# EAGLE design plc-6u-rs485-router (EAGLE 6.2)
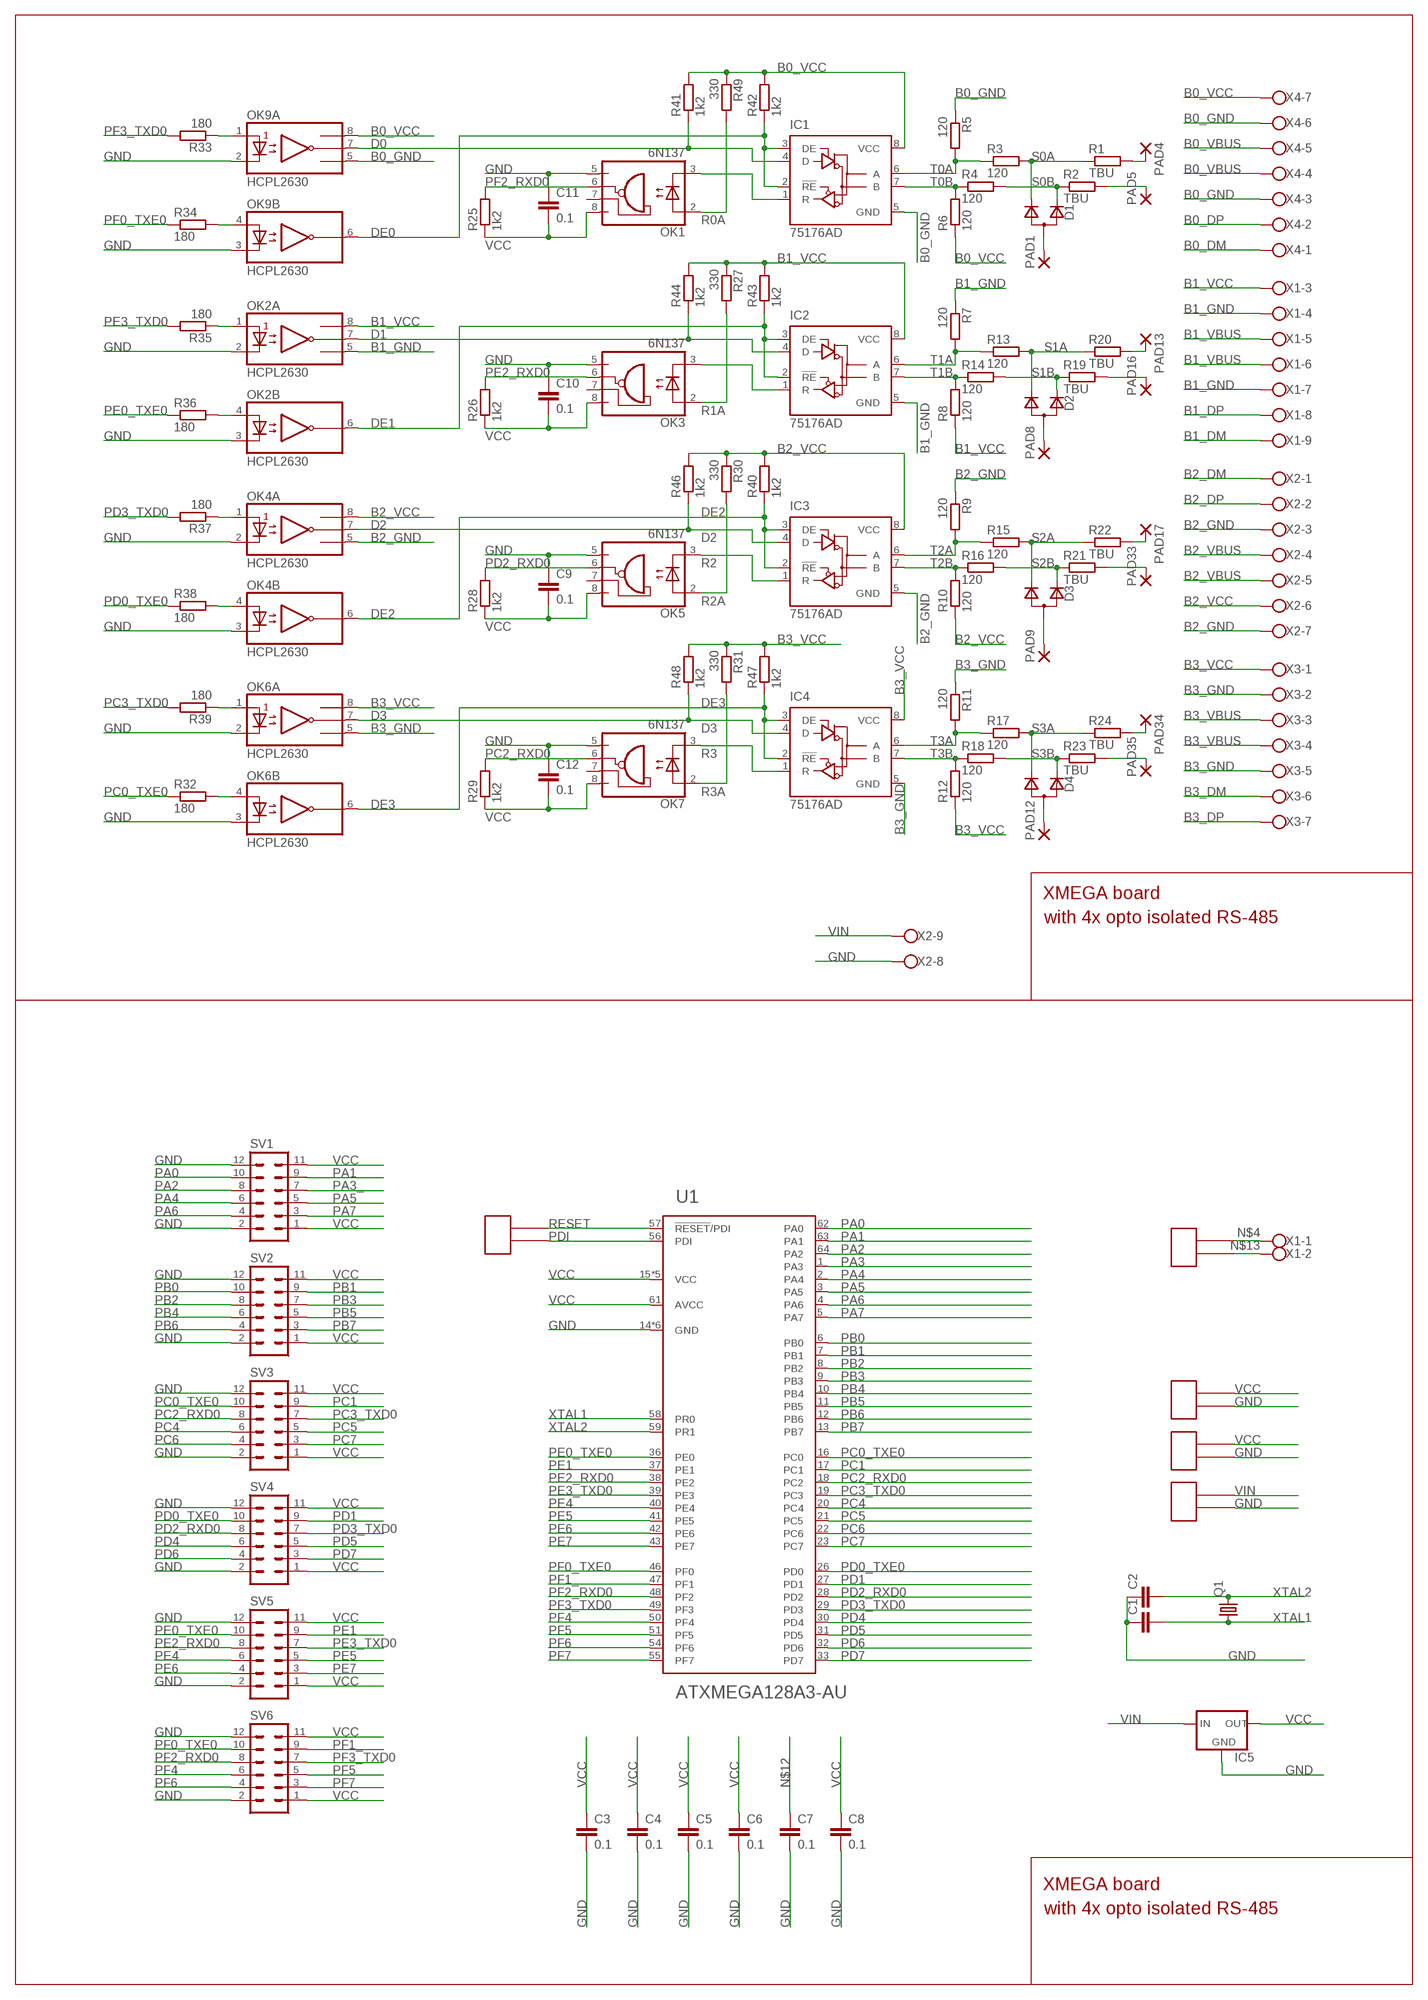
[diagram p0: schematic, sheet 1]

## Parts
C1  C-EUC0805  [C0805]
C2  C-EUC0805  [C0805]
C3  0.1  C-EUC0603  [C0603]
C4  0.1  C-EUC0603  [C0603]
C5  0.1  C-EUC0603  [C0603]
C6  0.1  C-EUC0603  [C0603]
C7  0.1  C-EUC0603  [C0603]
C8  0.1  C-EUC0603  [C0603]
C9  0.1  C-EUC1206  [C1206]
C10  0.1  C-EUC1206  [C1206]
C11  0.1  C-EUC1206  [C1206]
C12  0.1  C-EUC1206  [C1206]
D1  D_2CSOT323  [SOT323]
D2  D_2CSOT323  [SOT323]
D3  D_2CSOT323  [SOT323]
D4  D_2CSOT323  [SOT323]
IC1  75176AD  [D_R-PDSO-G8]
IC2  75176AD  [D_R-PDSO-G8]
IC3  75176AD  [D_R-PDSO-G8]
IC4  75176AD  [D_R-PDSO-G8]
IC5  LM1117TO252  [TO252]
OK1  6N137  [DIL08]
OK2  HCPL2630  [DIL08]
OK3  6N137  [DIL08]
OK4  HCPL2630  [DIL08]
OK5  6N137  [DIL08]
OK6  HCPL2630  [DIL08]
OK7  6N137  [DIL08]
OK9  HCPL2630  [DIL08]
PAD1  2,54/0,8  [2,54/0,8]
PAD4  2,54/0,8  [2,54/0,8]
PAD5  2,54/0,8  [2,54/0,8]
PAD8  2,54/0,8  [2,54/0,8]
PAD9  2,54/0,8  [2,54/0,8]
PAD12  2,54/0,8  [2,54/0,8]
PAD13  2,54/0,8  [2,54/0,8]
PAD16  2,54/0,8  [2,54/0,8]
PAD17  2,54/0,8  [2,54/0,8]
PAD33  2,54/0,8  [2,54/0,8]
PAD34  2,54/0,8  [2,54/0,8]
PAD35  2,54/0,8  [2,54/0,8]
Q1  CRYSTALHC49S  [HC49/S]
R1  TBU  R-EU_WSC2515  [WSC2515]
R2  TBU  R-EU_WSC2515  [WSC2515]
R3  120  R-EU_R0805  [R0805]
R4  120  R-EU_R0805  [R0805]
R5  120  R-EU_R0805  [R0805]
R6  120  R-EU_R0805  [R0805]
R7  120  R-EU_R0805  [R0805]
R8  120  R-EU_R0805  [R0805]
R9  120  R-EU_R0805  [R0805]
R10  120  R-EU_R0805  [R0805]
R11  120  R-EU_R0805  [R0805]
R12  120  R-EU_R0805  [R0805]
R13  120  R-EU_R0805  [R0805]
R14  120  R-EU_R0805  [R0805]
R15  120  R-EU_R0805  [R0805]
R16  120  R-EU_R0805  [R0805]
R17  120  R-EU_R0805  [R0805]
R18  120  R-EU_R0805  [R0805]
R19  TBU  R-EU_WSC2515  [WSC2515]
R20  TBU  R-EU_WSC2515  [WSC2515]
R21  TBU  R-EU_WSC2515  [WSC2515]
R22  TBU  R-EU_WSC2515  [WSC2515]
R23  TBU  R-EU_WSC2515  [WSC2515]
R24  TBU  R-EU_WSC2515  [WSC2515]
R25  1k2  R-EU_R0805  [R0805]
R26  1k2  R-EU_R0805  [R0805]
R27  330  R-EU_R0805  [R0805]
R28  1k2  R-EU_R0805  [R0805]
R29  1k2  R-EU_R0805  [R0805]
R30  330  R-EU_R0805  [R0805]
R31  330  R-EU_R0805  [R0805]
R32  180  R-EU_R1206  [R1206]
R33  180  R-EU_R0805  [R0805]
R34  180  R-EU_R1206  [R1206]
R35  180  R-EU_R0805  [R0805]
R36  180  R-EU_R1206  [R1206]
R37  180  R-EU_R0805  [R0805]
R38  180  R-EU_R1206  [R1206]
R39  180  R-EU_R0805  [R0805]
R40  1k2  R-EU_0207/10  [0207/10]
R41  1k2  R-EU_0207/10  [0207/10]
R42  1k2  R-EU_0207/10  [0207/10]
R43  1k2  R-EU_R0805  [R0805]
R44  1k2  R-EU_R0805  [R0805]
R46  1k2  R-EU_0207/10  [0207/10]
R47  1k2  R-EU_R0805  [R0805]
R48  1k2  R-EU_R0805  [R0805]
R49  330  R-EU_R0805  [R0805]
SV1  MA06-2  [MA06-2]
SV2  MA06-2  [MA06-2]
SV3  MA06-2  [MA06-2]
SV4  MA06-2  [MA06-2]
SV5  MA06-2  [MA06-2]
SV6  MA06-2  [MA06-2]
U1  ATXMEGA128A3-AU  [TQFP-64A-64]
U$1  MA02-1  [MA02-1]
U$2  MA02-1  [MA02-1]
U$3  MA02-1  [MA02-1]
U$4  MA02-1  [MA02-1]
U$5  MA02-1  [MA02-1]
X1  W237-09P  [W237-9P]
X2  W237-09P  [W237-9P]
X3  W237-07P  [W237-7P]
X4  W237-07P  [W237-7P]

## Nets
B0_DM: PAD4.1(P) R1.2 X4.1
B0_DP: PAD5.1(P) R2.2 X4.2
B0_GND: D1.1(A) IC1.5(GND) OK9.5(A:GND) PAD1.1(P) R5.1 X4.3 X4.6
B0_VBUS: X4.4 X4.5
B0_VCC: IC1.8(VCC) OK9.8(A:VCC) R6.1 R41.2 R42.2 R49.1 X4.7
B1_DM: PAD16.1(P) R19.2 X1.9
B1_DP: PAD13.1(P) R20.2 X1.8
B1_GND: D2.1(A) IC2.5(GND) OK2.5(A:GND) PAD8.1(P) R7.1 X1.4 X1.7
B1_VBUS: X1.5 X1.6
B1_VCC: IC2.8(VCC) OK2.8(A:VCC) R8.1 R27.1 R43.2 R44.2 X1.3
B2_DM: PAD17.1(P) R22.2 X2.1
B2_DP: PAD33.1(P) R21.2 X2.2
B2_GND: D3.1(A) IC3.5(GND) OK4.5(A:GND) PAD9.1(P) R9.1 X2.3 X2.7
B2_VBUS: X2.4 X2.5
B2_VCC: IC3.8(VCC) OK4.8(A:VCC) R10.1 R30.1 R40.2 R46.2 X2.6
B3_DM: PAD34.1(P) R24.2 X3.6
B3_DP: PAD35.1(P) R23.2 X3.7
B3_GND: D4.1(A) IC4.5(GND) OK6.5(A:GND) PAD12.1(P) R11.1 X3.2 X3.5
B3_VBUS: X3.3 X3.4
B3_VCC: IC4.8(VCC) OK6.8(A:VCC) R12.1 R31.1 R47.2 R48.2 X3.1
D0: IC1.4(D) OK9.7(A:VO1) R41.1
D1: IC2.4(D) OK2.7(A:VO1) R44.1
D2: IC3.4(D) OK4.7(A:VO1) R46.1
D3: IC4.4(D) OK6.7(A:VO1) R48.1
DE0: IC1.2(!RE) IC1.3(DE) OK9.6(B:VO2) R42.1
DE1: IC2.2(!RE) IC2.3(DE) OK2.6(B:VO2) R43.1
DE2: IC3.2(!RE) IC3.3(DE) OK4.6(B:VO2) R40.1
DE3: IC4.2(!RE) IC4.3(DE) OK6.6(B:VO2) R47.1
GND: C1.1 C2.1 C3.2 C4.2 C5.2 C6.2 C7.2 C8.2 C9.1 C10.1 C11.1 C12.1 IC5.1(GND) OK1.5(GND) OK2.2(A:C1) OK2.3(B:C2) OK3.5(GND) OK4.2(A:C1) OK4.3(B:C2) OK5.5(GND) OK6.2(A:C1) OK6.3(B:C2) OK7.5(GND) OK9.2(A:C1) OK9.3(B:C2) SV1.2 SV1.12 SV2.2 SV2.12 SV3.2 SV3.12 SV4.2 SV4.12 SV5.2 SV5.12 SV6.2 SV6.12 U1.14(GND) U1.24(GND) U1.34(GND) U1.44(GND) U1.52(GND) U1.60(GND) U$2.P1 U$3.P1 U$4.P1 X2.8
N$1: OK9.4(B:A2) R34.2
N$2: OK2.4(B:A2) R36.2
N$4: U$5.P2 X1.1
N$5: OK2.1(A:A1) R35.1
N$7: OK4.1(A:A1) R37.1
N$8: OK9.1(A:A1) R33.1
N$9: OK4.4(B:A2) R38.2
N$12: C7.1
N$13: U$5.P1 X1.2
PA0: SV1.10 U1.62(PA0)
PA1: SV1.9 U1.63(PA1)
PA2: SV1.8 U1.64(PA2)
PA3: U1.1(PA3)
PA3_: SV1.7
PA4: SV1.6 U1.2(PA4)
PA5: SV1.5 U1.3(PA5)
PA6: SV1.4 U1.4(PA6)
PA7: SV1.3 U1.5(PA7)
PB0: SV2.10 U1.6(PB0)
PB1: SV2.9 U1.7(PB1)
PB2: SV2.8 U1.8(PB2)
PB3: SV2.7 U1.9(PB3)
PB4: SV2.6 U1.10(PB4)
PB5: SV2.5 U1.11(PB5)
PB6: SV2.4 U1.12(PB6)
PB7: SV2.3 U1.13(PB7)
PC0_TXE0: R32.1 SV3.10 U1.16(PC0)
PC1: SV3.9 U1.17(PC1)
PC2_RXD0: OK7.6(VO) R29.2 SV3.8 U1.18(PC2)
PC3_TXD0: R39.2 SV3.7 U1.19(PC3)
PC4: SV3.6 U1.20(PC4)
PC5: SV3.5 U1.21(PC5)
PC6: SV3.4 U1.22(PC6)
PC7: SV3.3 U1.23(PC7)
PD0_TXE0: R38.1 SV4.10 U1.26(PD0)
PD1: SV4.9 U1.27(PD1)
PD2_RXD0: OK5.6(VO) R28.2 SV4.8 U1.28(PD2)
PD3_TXD0: R37.2 SV4.7 U1.29(PD3)
PD4: SV4.6 U1.30(PD4)
PD5: SV4.5 U1.31(PD5)
PD6: SV4.4 U1.32(PD6)
PD7: SV4.3 U1.33(PD7)
PDI: U1.56(PDI) U$1.P1
PE0_TXE0: R36.1 SV5.10 U1.36(PE0)
PE1: SV5.9 U1.37(PE1)
PE2_RXD0: OK3.6(VO) R26.2 SV5.8 U1.38(PE2)
PE3_TXD0: R35.2 SV5.7 U1.39(PE3)
PE4: SV5.6 U1.40(PE4)
PE5: SV5.5 U1.41(PE5)
PE6: SV5.4 U1.42(PE6)
PE7: SV5.3 U1.43(PE7)
PF0_TXE0: R34.1 SV6.10 U1.46(PF0)
PF1_: SV6.9 U1.47(PF1)
PF2_RXD0: OK1.6(VO) R25.2 SV6.8 U1.48(PF2)
PF3_TXD0: R33.2 SV6.7 U1.49(PF3)
PF4: SV6.6 U1.50(PF4)
PF5: SV6.5 U1.51(PF5)
PF6: SV6.4 U1.54(PF6)
PF7: SV6.3 U1.55(PF7)
R0: IC1.1(R) OK1.3(C)
R0A: OK1.2(A) R49.2
R1: IC2.1(R) OK3.3(C)
R1A: OK3.2(A) R27.2
R2: IC3.1(R) OK5.3(C)
R2A: OK5.2(A) R30.2
R3: IC4.1(R) OK7.3(C)
R3A: OK7.2(A) R31.2
RESET: U1.57(!RESET!/PDI) U$1.P2
S0A: D1.3(C2) R1.1 R3.2
S0B: D1.2(C1) R2.1 R4.2
S1A: D2.3(C2) R13.2 R20.1
S1B: D2.2(C1) R14.2 R19.1
S2A: D3.3(C2) R15.2 R22.1
S2B: D3.2(C1) R16.2 R21.1
S3A: D4.3(C2) R17.2 R24.1
S3B: D4.2(C1) R18.2 R23.1
T0A: IC1.6(A) R3.1 R5.2
T0B: IC1.7(B) R4.1 R6.2
T1A: IC2.6(A) R7.2 R13.1
T1B: IC2.7(B) R8.2 R14.1
T2A: IC3.6(A) R9.2 R15.1
T2B: IC3.7(B) R10.2 R16.1
T3A: IC4.6(A) R11.2 R17.1
T3B: IC4.7(B) R12.2 R18.1
TX3A: OK6.1(A:A1) R39.1
TXE3A: OK6.4(B:A2) R32.2
VCC: C3.1 C4.1 C5.1 C6.1 C8.1 C9.2 C10.2 C11.2 C12.2 IC5.3(OUT) OK1.8(VCC) OK3.8(VCC) OK5.8(VCC) OK7.8(VCC) R25.1 R26.1 R28.1 R29.1 SV1.1 SV1.11 SV2.1 SV2.11 SV3.1 SV3.11 SV4.1 SV4.11 SV5.1 SV5.11 SV6.1 SV6.11 U1.15(VCC) U1.25(VCC) U1.35(VCC) U1.45(VCC) U1.53(VCC) U1.61(AVCC) U$2.P2 U$3.P2
VIN: IC5.2(IN) U$4.P2 X2.9
XTAL1: C1.2 Q1.1 U1.58(PR0)
XTAL2: C2.2 Q1.2 U1.59(PR1)
Unconnected: OK1.7(VE) OK3.7(VE) OK5.7(VE) OK7.7(VE)

## Notes on the sheet
- XMEGA board
- with 4x opto isolated RS-485
- XMEGA board
- with 4x opto isolated RS-485

## Library data of the parts
C1-C12 = rcl:C-EU: CAPACITOR, European symbol
D1-D4 = zetex:D_2C: Dual DIODE; OC_FARNELL: unknown; OC_NEWARK: unknown
IC1-IC4 = 751xx:75176A: DIFFERENTIAL BUS TRANSCEIVER Source: http://focus.ti.com/lit/ds/symlink/sn75176a.pdf
IC5 = my-v-reg-3:LM1117
OK1 OK3 OK5 OK7 = optocoupler:6N137: MOTOROLA OPTO COUPLER; MPN: 6N137; OC_FARNELL: 1328376; OC_NEWARK: 52M1895
OK2 OK4 OK6 OK9 = optocoupler:HCPL2630: HEWLETT PACKARD OPTO COUPLER; MF: AGILENT TECHNOLOGIES; MPN: HCPL-2630-000E; OC_FARNELL: 9994904; OC_NEWARK: 88H7813
PAD1 PAD4 PAD5 PAD8 PAD9 PAD12 PAD13 PAD16 PAD17 PAD33-PAD35 = wirepad:2,54/0,8: THROUGH-HOLE PAD
Q1 = crystal:CRYSTAL: CRYSTAL
R1-R39 R43 R44 R47-R49 = rcl:R-EU_: RESISTOR, European symbol
R40-R42 R46 = resistor:R-EU_: RESISTOR, European symbol
SV1-SV6 = con-lstb:MA06-2: PIN HEADER; OC_FARNELL: unknown; OC_NEWARK: unknown
U1 = atmel-xmega:ATXMEGA128A3: 8/16-bit XMEGA A3 Microcontroller Features High-performance, Low-power 8/16-bit Atmel® AVR® XMEGATM Microcontroller Non-volatile Program and Data Memories – 64 KB - 256 KB of In-System Self-Programmable Flash – 4 KB - 8 KB Boot Code Section with Independent Lock Bits – 2 KB - 4 KB EEPROM – 4 KB - 16 KB Internal SRAM Peripheral Features – Four-channel DMA Controller with support for external requests – Eight-channel Event System – Seven 16-bit Timer/Counters Four Timer/Counters with 4 Output Compare or Input Capture channels Three Timer/Counters with 2 Output Compare or Input Capture channels High Resolution Extensions on all Timer/Counters Advanced Waveform Extension on one Timer/Counter – Seven USARTs IrDA Extension on 1 USART – AES and DES Crypto Engine – Two Two-wire Interfaces with dual address match (I2C and SMBus compatible) – Three SPI (Serial Peripheral Interfaces) – 16-bit Real Time Counter with Separate Oscillator – Two Eight-channel, 12-bit, 2 Msps Analog to Digital Converters – One Two-channel, 12-bit, 1 Msps Digital to Analog Converter – Four Analog Comparators with Window compare function – External Interrupts on all General Purpose I/O pins – Programmable Watchdog Timer with Separate On-chip Ultra Low Power Oscillator Special Microcontroller Features – Power-on Reset and Programmable Brown-out Detection – Internal and External Clock Options with PLL – Programmable Multi-level Interrupt Controller – Sleep Modes: Idle, Power-down, Standby, Power-save, Extended Standby – Advanced Programming, Test and Debugging Interfaces JTAG (IEEE 1149.1 Compliant) Interface for test, debug and programming PDI (Program and Debug Interface) for programming, test and debugging I/O and Packages – 50 Programmable I/O Lines – 64-lead TQFP – 64-pad QFN Operating Voltage – 1.6 – 3.6V Speed performance – 0 – 12 MHz @ 1.6 – 3.6V – 0 – 32 MHz @ 2.7 – 3.6V
U$1-U$5 = my-con:MA02-1
X1 X2 = con-wago-508:W237-09P: WAGO SREW CLAMP
X3 X4 = con-wago-508:W237-07P: WAGO SREW CLAMP

## Board
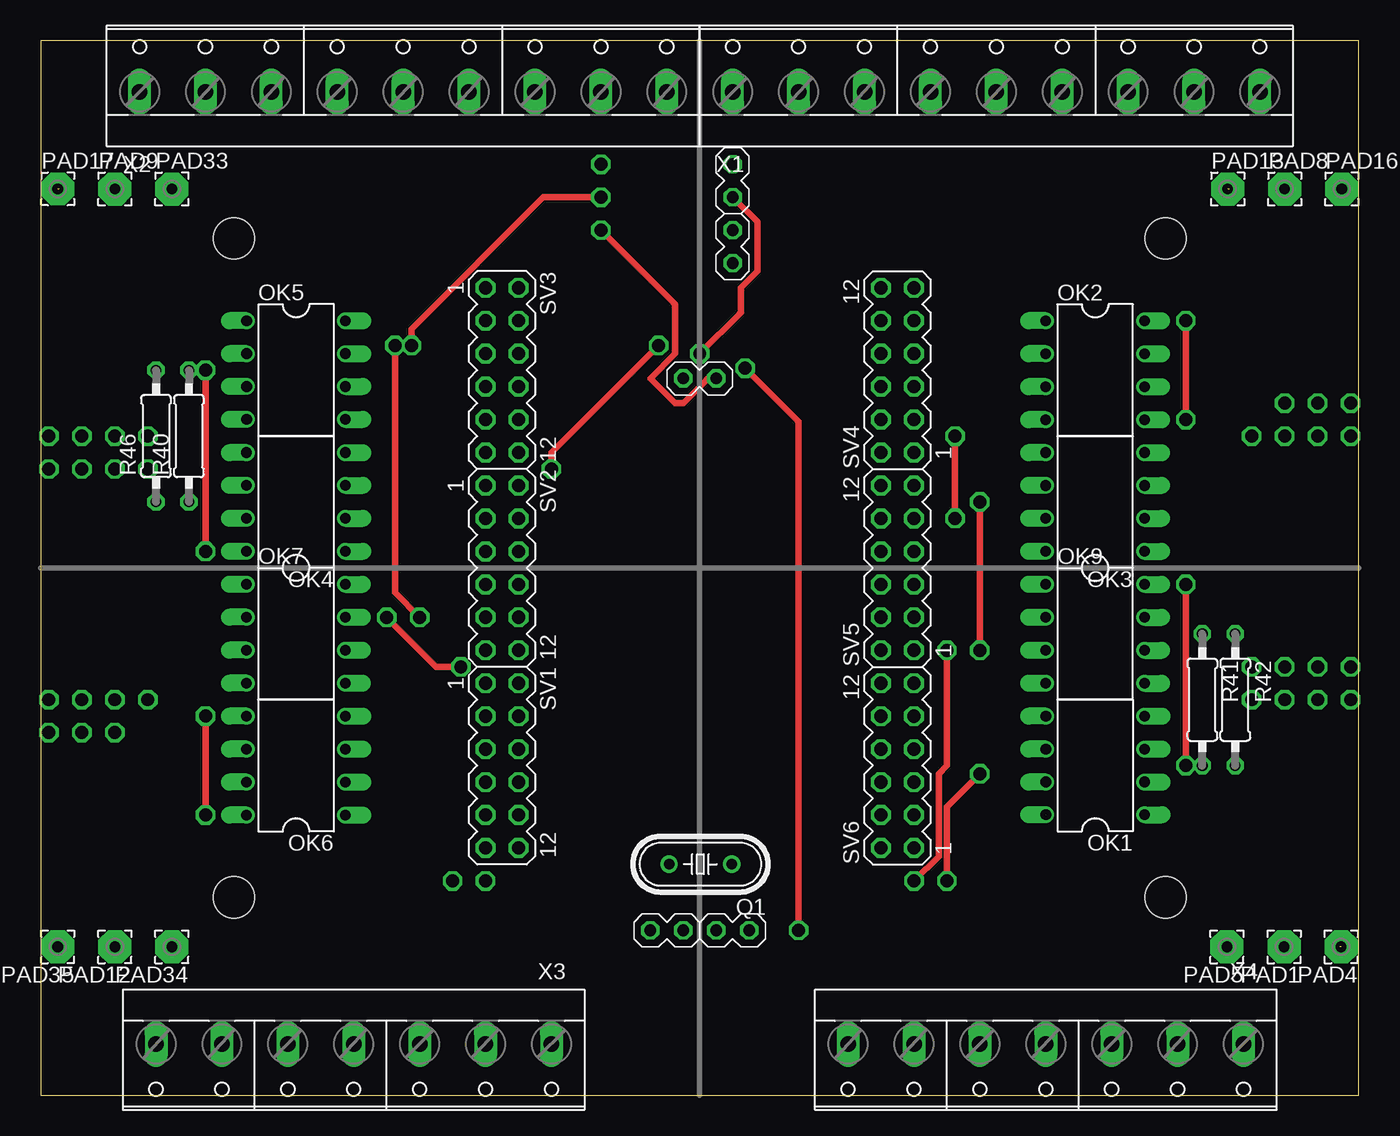
[diagram p1: board, top side]
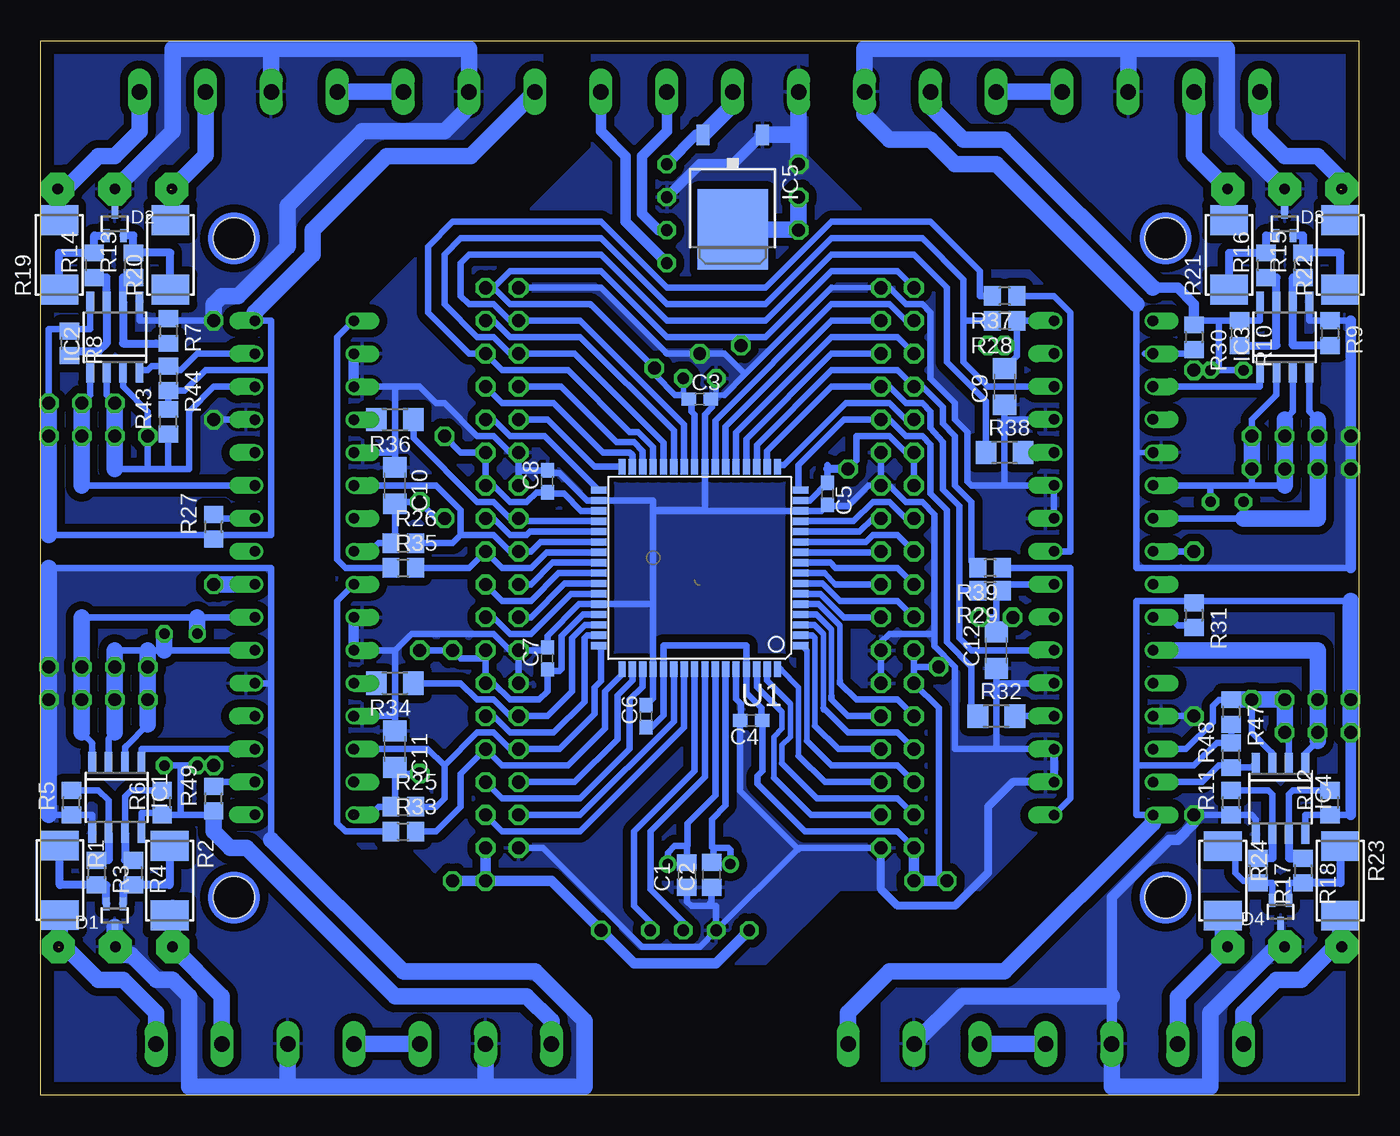
[diagram p2: board, bottom side, seen from below]

Size 101.6 x 81.28 mm. Coordinates in mm from the lower left corner, seen from the top.
Outline: 0,0.01 101.6,0 101.6,81.28 0,81.28 0,0.01
Copper layers (1*16): Top 0.035mm / dielectric 1.5mm / Bottom 0.035mm
Design rules: minimum track width 10mil, minimum drill 24mil, track to track 8mil, track to pad 8mil, pad to pad 8mil, via to via 8mil, smd to smd 8mil, copper to edge 40mil, drill to drill 8mil, minimum pad ring 10mil, minimum via ring 8mil, stop-mask expansion 4mil, vias tented up to drill 0mil, thermal gap 10mil
Holes 3.2 mm at 14.9,15.24 14.9,66.04 86.7,15.24 86.7,66.04

### Footprints (pad centres in the part's own frame; a part is rotated, then mirrored left to right if it is on the bottom)
C0805 = smd 1.3 x 1.5: 1 -0.95,0; 2 0.95,0
C0603 = smd 1.1 x 1: 1 -0.85,0; 2 0.85,0
C1206 = smd 1.6 x 1.8: 1 -1.4,0; 2 1.4,0
SOT323 = smd 0.5 x 1: 1 0,0.9; 2 -0.65,-0.9; 3 0.65,-0.9
D_R-PDSO-G8 = smd 0.6 x 1.5: 1 -1.905,-2.75; 2 -0.635,-2.75; 3 0.635,-2.75; 4 1.905,-2.75; 5 1.905,2.75; 6 0.635,2.75; 7 -0.635,2.75; 8 -1.905,2.75
TO252 = smd 1 x 1.6: 1 -2.28,-6.07; 2 2.28,-6.07 | smd 5.4 x 6.2: 3 0,1.23
DIL08 = drill 0.813 offset: 1 -3.81,-3.81; 2 -1.27,-3.81; 3 1.27,-3.81; 4 3.81,-3.81; 5 3.81,3.81; 6 1.27,3.81; 7 -1.27,3.81; 8 -3.81,3.81
2,54/0,8 = drill 0.813 pad 2.54 octagon: 1 0,0
HC49/S = drill 0.813: 1 -2.413,0; 2 2.413,0
WSC2515 = smd 2.29 x 2.92: 1 -2.675,0; 2 2.675,0
R0805 = smd 1.3 x 1.5: 1 -0.95,0; 2 0.95,0
R1206 = smd 1.6 x 1.803: 1 -1.422,0; 2 1.422,0
0207/10 = drill 0.813 octagon: 1 -5.08,0; 2 5.08,0
MA06-2 = drill 1.016 octagon: 1 -6.35,-1.27; 2 -6.35,1.27; 3 -3.81,-1.27; 4 -3.81,1.27; 5 -1.27,-1.27; 6 -1.27,1.27; 7 1.27,-1.27; 8 1.27,1.27; 9 3.81,-1.27; 10 3.81,1.27; 11 6.35,-1.27; 12 6.35,1.27
TQFP-64A-64 = smd 1.194 x 0.559: 1 -7.8,6; 2 -7.8,5.2; 3 -7.8,4.4; 4 -7.8,3.6; 5 -7.8,2.8; 6 -7.8,2; 7 -7.8,1.2; 8 -7.8,0.4; 9 -7.8,-0.4; 10 -7.8,-1.2; 11 -7.8,-2; 12 -7.8,-2.8; 13 -7.8,-3.6; 14 -7.8,-4.4; 15 -7.8,-5.2; 16 -7.8,-6; 33 7.8,-6; 34 7.8,-5.2; 35 7.8,-4.4; 36 7.8,-3.6; 37 7.8,-2.8; 38 7.8,-2; 39 7.8,-1.2; 40 7.8,-0.4; 41 7.8,0.4; 42 7.8,1.2; 43 7.8,2; 44 7.8,2.8; 45 7.8,3.6; 46 7.8,4.4; 47 7.8,5.2; 48 7.8,6 | smd 0.559 x 1.194: 17 -6,-7.8; 18 -5.2,-7.8; 19 -4.4,-7.8; 20 -3.6,-7.8; 21 -2.8,-7.8; 22 -2,-7.8; 23 -1.2,-7.8; 24 -0.4,-7.8; 25 0.4,-7.8; 26 1.2,-7.8; 27 2,-7.8; 28 2.8,-7.8; 29 3.6,-7.8; 30 4.4,-7.8; 31 5.2,-7.8; 32 6,-7.8; 49 6,7.8; 50 5.2,7.8; 51 4.4,7.8; 52 3.6,7.8; 53 2.8,7.8; 54 2,7.8; 55 1.2,7.8; 56 0.4,7.8; 57 -0.4,7.8; 58 -1.2,7.8; 59 -2,7.8; 60 -2.8,7.8; 61 -3.6,7.8; 62 -4.4,7.8; 63 -5.2,7.8; 64 -6,7.8
MA02-1 = drill 0.9 octagon: P1 -1.27,0; P2 1.27,0
W237-9P = drill 1.194 long: 1 -20.32,-0.635; 2 -15.24,-0.635; 3 -10.16,-0.635; 4 -5.08,-0.635; 5 0,-0.635; 6 5.08,-0.635; 7 10.16,-0.635; 8 15.24,-0.635; 9 20.32,-0.635
W237-7P = drill 1.194 long: 1 -15.24,-0.635; 2 -10.16,-0.635; 3 -5.08,-0.635; 4 0,-0.635; 5 5.08,-0.635; 6 10.16,-0.635; 7 15.24,-0.635

### Placement (x,y rotation side)
C1  51.8,16.97 90 bottom
C2  49.89,16.98 90 bottom
C3  50.8,53.66 0 bottom
C4  46.83,28.89 180 bottom
C5  40.96,46.35 270 bottom
C6  54.93,29.21 90 bottom
C7  62.55,33.66 90 bottom
C8  62.55,47.31 90 bottom
C9  27.31,54.61 90 bottom
C10  74.3,46.99 270 bottom
C11  74.3,26.67 270 bottom
C12  27.94,34.29 90 bottom
D1  95.89,13.86 180 bottom
D2  95.89,67.15 0 bottom
D3  5.72,67.15 0 bottom
D4  6.04,14.13 180 bottom
IC1  95.74,22.95 180 bottom
IC2  95.89,58.42 0 bottom
IC3  5.72,58.42 0 bottom
IC4  6.04,22.86 180 bottom
IC5  48.26,67.94 180 bottom
OK1  81.29,25.41 90 top
OK2  81.28,55.88 270 top
OK3  81.28,45.72 90 top
OK4  19.69,45.72 90 top
OK5  19.69,55.89 270 top
OK6  19.69,25.4 90 top
OK7  19.68,35.57 270 top
OK9  81.28,35.56 270 top
PAD1  95.84,11.43 180 top
PAD4  100.24,11.43 180 top
PAD5  91.44,11.43 180 top
PAD8  95.89,69.85 0 top
PAD9  5.72,69.85 0 top
PAD12  5.72,11.43 180 top
PAD13  91.49,69.85 0 top
PAD16  100.29,69.85 0 top
PAD17  1.32,69.85 0 top
PAD33  10.12,69.85 0 top
PAD34  10.12,11.43 180 top
PAD35  1.32,11.43 180 top
Q1  50.85,17.8 180 top
R1  100.12,16.55 270 bottom
R2  91.66,16.54 270 bottom
R3  97.32,17.14 270 bottom
R4  94.46,17.14 270 bottom
R5  99.22,22.54 90 bottom
R6  92.24,22.54 90 bottom
R7  91.76,58.9 270 bottom
R8  99.38,57.94 270 bottom
R9  2.23,58.74 270 bottom
R10  9.21,58.74 270 bottom
R11  9.85,22.54 90 bottom
R12  2.23,22.54 90 bottom
R13  94.46,63.98 90 bottom
R14  97.48,63.98 90 bottom
R15  4.29,63.98 90 bottom
R16  7.15,63.98 90 bottom
R17  7.78,17.3 270 bottom
R18  4.29,17.3 270 bottom
R19  100.17,64.77 90 bottom
R20  91.6,64.77 90 bottom
R21  10,64.77 90 bottom
R22  1.43,64.77 90 bottom
R23  1.43,16.51 270 bottom
R24  10.48,16.51 270 bottom
R25  73.66,22.23 0 bottom
R26  73.66,42.55 0 bottom
R27  88.27,43.81 90 bottom
R28  27.31,59.69 180 bottom
R29  28.42,38.89 180 bottom
R30  12.7,58.42 270 bottom
R31  12.7,36.99 270 bottom
R32  27.94,29.21 0 bottom
R33  73.66,20.32 0 bottom
R34  74.3,31.75 180 bottom
R35  73.66,40.64 0 bottom
R36  74.3,52.07 180 bottom
R37  27.31,61.59 180 bottom
R38  27.31,49.53 0 bottom
R39  28.42,40.64 180 bottom
R40  11.43,50.8 90 top
R41  89.54,30.48 270 top
R42  92.08,30.48 270 top
R43  91.76,51.91 90 bottom
R44  91.76,55.24 270 bottom
R46  8.89,50.8 90 top
R47  9.85,29.53 270 bottom
R48  9.85,26.19 90 bottom
R49  88.27,22.86 90 bottom
SV1  35.56,25.4 270 top
SV2  35.56,40.64 270 top
SV3  35.56,55.88 270 top
SV4  66.04,55.88 90 top
SV5  66.04,40.64 90 top
SV6  66.04,25.4 90 top
U1  50.8,40.64 180 bottom
U$1  53.34,12.7 180 top
U$2  48.26,12.7 180 top
U$3  50.8,55.24 0 top
U$4  53.34,70.48 90 top
U$5  53.34,65.41 90 top
X1  73.66,77.98 0 top
X2  27.94,77.98 0 top
X3  24.13,3.3 180 top
X4  77.47,3.3 180 top

### Tracks (layer width: path | path; a pad name or v marks a point on that pad's centre or on a via)
B0_DM  (1 unrouted)
  Bottom 1.27: 100.12,11.43 R1.2 | PAD4.1 99.7,11.43 97.16,8.89 95.25,8.89 92.71,6.35 X4.1
B0_DP
  Bottom 0.61: 91.44,14.45 91.66,14.45 R2.2
  Bottom 1.27: 91.44,14.45 PAD5.1 87.63,7.62 X4.2
B0_GND  (via drill 1)
  Bottom 0.508: 100.97,21.59 99.06,21.59 R5.1 97.64,21.59 IC1.5 | 100.97,40.64 83.82,40.64 83.82,31.75 | 83.82,31.75 83.82,19.68 | PAD1.1 95.84,12.96 D1.1 | OK9.5 83.82,31.75
  Bottom 1.27: 100.97,40.64 v100.97,33.02 v100.97,30.48 100.97,21.59 | X4.3 82.55,0.64 | 82.55,0.64 67.31,0.64 | 67.31,0.64 X4.6 | 83.82,19.68 73.66,9.53 63.5,9.53 59.69,5.71 59.69,0.64 67.31,0.64 | D1.1 95.89,10.79 94.62,10.79 92.71,8.89 91.44,8.89 90.17,7.62 90.17,0.64 82.55,0.64
  pour Bottom (isolate 0.61): 59.06,0 59.06,5.71 63.5,10.16 73.66,10.16 83.82,20.32 83.82,40.64 101.6,40.64 101.6,0
B0_VBUS
  Bottom 1.27: X4.5 X4.4
B0_VCC  (via drill 1)
  Top 0.508: v88.27,39.37 v88.27,25.4
  Bottom 0.508: IC1.8 93.83,21.74 92.39,21.74 | 92.39,21.74 R6.1 | v88.27,25.4 R41.2 90.81,25.4 | 90.81,25.4 R42.2 | 92.39,21.74 92.39,21.59 90.81,21.59 | 90.81,21.59 90.81,25.4 | 90.81,21.59 88.59,21.59 arc-90 R49.1
  Bottom 1.27: OK9.8 v88.27,39.37 | R49.1 88.27,20.32 87,19.05 85.73,19.05 74.3,7.62 64.14,7.62 62.23,5.71 X4.7
B1_DM
  Bottom 0.61: PAD16.1 100.17,69.85 R19.2
  Bottom 1.27: X1.9 93.98,76.83 93.98,76.04 93.98,74.3 95.89,72.39 97.16,72.39 99.7,69.85 100.17,69.85
B1_DP  (1 unrouted)
  Bottom 0.61: 91.6,69.85 R20.2
  Bottom 1.27: PAD13.1 88.9,72.44 X1.8
B1_GND  (via drill 1)
  Top 0.508: v88.27,52.07 v88.27,59.69
  Bottom 0.508: IC2.5 93.98,59.69 92.56,59.69 R7.1 91.6,59.69 v88.27,59.69 | OK2.5 v88.27,52.07 | D2.1 PAD8.1
  Bottom 1.27: PAD8.1 91.44,74.3 91.44,80.64 83.82,80.64 | 83.82,80.64 68.58,80.64 X1.4 68.58,76.2 70.49,74.3 76.84,74.3 82.55,68.58 82.55,65.41 86.36,61.59 87.63,61.59 88.27,60.96 v88.27,59.69 | X1.7 83.82,80.64
  pour Bottom (isolate 0.61): 62.87,81.28 101.6,81.28 101.6,42.55 83.82,42.55 83.82,60.33 80.01,64.14 80.01,66.04 74.3,71.75 67.95,71.75 62.87,76.83
B1_VBUS
  Bottom 1.27: X1.5 X1.6
B1_VCC  (via drill 1)
  Bottom 0.508: 99.22,59.05 97.79,59.05 IC2.8 | 99.22,59.05 R8.1 | 99.22,59.05 100.97,59.05 v100.97,53.34 | 100.97,43.18 88.27,43.18 | 88.27,43.18 83.82,43.18 83.82,55.88 | 83.82,55.88 83.82,59.69 OK2.8 | R27.1 88.27,43.18 | R43.2 R44.2 90.49,54.3 88.9,55.88 83.82,55.88
  Bottom 1.27: v100.97,53.34 v100.97,50.8 100.97,43.18 | X1.3 68.46,72.39 74.93,72.39 80.65,66.67 80.65,64.77 85.09,60.33 OK2.8
B2_DM  (1 unrouted)
  Bottom 0.61: 1.43,69.85 R22.2
  Bottom 1.27: X2.1 7.62,76.83 7.62,76.04 7.62,74.3 5.72,72.39 3.18,72.39 1.43,70.64 1.43,69.85
B2_DP
  Bottom 0.61: PAD33.1 10,69.85 R21.2
  Bottom 1.27: PAD33.1 12.7,72.44 X2.2
B2_GND  (via drill 1)
  Bottom 0.406: OK4.5 17.15,49.53
  Bottom 0.508: IC3.5 3.81,59.69 R9.1 | R9.1 | R9.1 0.64,59.69 | 0.64,40.64 17.15,40.64 17.15,49.53 17.15,60.96
  Bottom 0.61: D3.1 PAD9.1
  Bottom 0.813: 0.64,59.69 v0.64,50.8 v0.64,48.26 0.64,40.64
  Bottom 1.27: 17.78,80.64 38.1,80.64 X2.7 38.1,75.56 36.2,73.66 33.02,73.66 31.12,71.75 27.94,71.75 17.15,60.96 | 17.78,80.64 10.16,80.64 10.16,74.3 PAD9.1 | X2.3 17.78,80.64
  pour Bottom (isolate 0.61): 0,81.28 0,40.64 17.15,40.64 17.15,60.33 29.85,73.03 36.2,73.03 38.74,75.56 38.74,81.28
B2_VBUS
  Bottom 1.27: X2.4 X2.5
B2_VCC  (via drill 1)
  Top 0.508: v12.7,55.88 v12.7,41.91
  Bottom 0.508: IC3.8 7.62,59.69 R10.1 | R10.1 | R10.1 10.8,59.69 | 10.8,59.69 12.38,59.69 R30.1 | 10.8,55.88 R40.2 v12.7,55.88 | 10.8,55.88 R46.2 | v12.7,41.91 OK4.8 | 10.8,59.69 10.8,55.88
  Bottom 0.813: R30.1 12.7,60.96 13.97,62.23 15.88,62.23
  Bottom 1.27: 33.02,76.83 X2.6 33.02,76.2 30.48,73.66 27.31,73.66 15.88,62.23
B3_DM
  Bottom 1.27: 10.48,13.61 R24.2 10.48,11.79 PAD34.1 13.97,7.58 X3.6
B3_DP
  Bottom 1.27: R23.2 1.43,11.54 PAD35.1 1.91,11.43 4.45,8.89 6.35,8.89 8.89,6.35 X3.7 8.81,3.94
B3_GND  (via drill 1)
  Top 0.508: v12.7,29.21 v12.7,21.59
  Bottom 0.508: v12.7,29.21 OK6.5 | 9.53,21.27 R11.1 | IC4.5 7.94,21.27 8.26,21.59 R11.1 | R11.1 11.43,21.59 v12.7,21.59 | D4.1 6.04,11.43
  Bottom 0.813: v12.7,21.59 12.7,20.95 13.97,19.68 14.61,19.68 19.05,15.24 19.05,7.62 X3.5
  Bottom 1.27: X3.5 19.05,0.64 11.43,0.64 11.43,6.35 6.35,11.43 PAD12.1 | X3.2 30.61,7.62 19.05,7.62
  pour Bottom (isolate 0.61): 0,38.73 17.15,38.73 17.15,20.32 27.31,10.16 36.83,10.16 36.83,0 0,0
B3_VBUS
  Bottom 1.27: X3.4 X3.3
B3_VCC  (via drill 1)
  Bottom 0.508: OK6.8 17.15,21.59 17.15,25.4 | 17.15,25.4 17.15,38.1 12.7,38.1 | 0.64,21.59 R12.1 | R12.1 | R12.1 4.13,21.59 IC4.8 | 0.64,38.1 12.7,38.1 | 12.7,38.1 R31.1 | R47.2 R48.2 10.96,27.14 12.7,25.4 17.15,25.4
  Bottom 0.813: 0.64,21.59 v0.64,27.94
  Bottom 1.27: v0.64,27.94 v0.64,30.48 0.64,38.1 | OK6.8 15.88,20.95 27.31,9.53 36.2,9.53 39.37,6.35 X3.1
D0
  Bottom 0.508: OK9.7 89.54,36.83 98.43,36.83 | 98.43,27.94 97.72,27.23 arc45 97.64,27.05 IC1.4
  Bottom 1.27: 89.54,36.83 R41.1 | 98.43,36.83 98.43,27.94
D1
  Bottom 0.508: 93.98,55.24 IC2.4 93.77,55.88 93.35,55.88 93.03,56.2 R44.1 arc-45 91.77,55.88 90.81,55.88 89.54,57.15 OK2.7
D2
  Bottom 0.508: OK4.7 8.89,44.45 R46.1 | 3.18,52.07 3.74,52.63 arc45 3.81,52.81 IC3.4
  Bottom 0.61: IC3.4 3.81,55.24
  Bottom 1.27: 8.89,44.45 3.18,44.45 3.18,52.07
D3
  Bottom 0.508: 7.94,25.08 IC4.4 8.31,25.24 R48.1 10,25.4 10.8,25.4 12.07,24.13 OK6.7
DE0
  Bottom 0.508: OK9.6 92.08,34.29 93.35,34.29 95.89,34.29 | 95.89,27.94 96.3,27.53 arc-45 96.37,27.35 IC1.3 | IC1.2 95.1,26.72 arc45 95.03,26.9 93.35,28.57
  Bottom 1.27: 92.08,34.29 R42.1 | 95.89,34.29 95.89,27.94 | 93.35,28.57 93.35,34.29
DE1
  Bottom 0.508: OK2.6 88.27,54.61 90.17,52.7 90.17,48.26 91.76,48.26 | IC2.3 95.25,54.61 93.35,52.7 93.35,48.26 | 93.35,48.26 95.89,48.26 | 95.89,53.34 96.52,53.98 IC2.2 | R43.1 91.76,48.26 | 91.76,48.26 93.35,48.26
  Bottom 1.27: 95.89,48.26 95.89,53.34
DE2
  Bottom 0.508: OK4.6 11.43,46.99 | R40.1 11.43,46.99 | 11.43,46.99 8.26,46.99 | 8.26,46.99 5.72,46.99 | 5.72,52.07 5.16,52.63 arc-45 5.08,52.81 IC3.3 | IC3.2 6.35,54.08 arc45 6.43,53.9 8.26,52.07 8.26,50.8 | 8.26,48.26 8.26,46.99
  Bottom 1.27: 5.72,46.99 5.72,52.07 | 8.26,50.8 8.26,48.26
DE3  (via drill 1)
  Bottom 0.508: 9.53,30.16 R47.1 | OK6.6 13.34,26.67 11.27,28.73 11.27,30 10.8,30.48 R47.1 | R47.1 arc-90 R47.1 | 5.72,27.94 5.48,27.7 arc45 5.4,27.52 IC4.2 | IC4.3 6.67,26.25 arc-45 6.75,26.43 8.26,27.94 v8.26,30.48
  Bottom 1.27: R47.1 v8.26,30.48 5.72,30.48 5.72,27.94
GND  (via drill 1)
  Top 0.508: U$4.P1 55.25,67.31 55.25,63.5 53.98,62.23 53.98,60.43 arc-45 53.9,60.25 v50.8,57.15
  Bottom 0.406: U$3.P1 49.53,54.08 | 49.53,54.08 C3.2 | SV3.2 40.64,62.23 | 48.9,53.98 49.43,53.98 49.53,54.08
  Bottom 0.508: 54.4,37.84 U1.52 54.4,30.59 C6.2 | 54.4,37.84 U1.44 60.11,37.84 62.55,35.4 C7.2 62.77,34.29 SV5.2 | U1.60 48,30.54 47.63,30.16 47.63,28.95 C4.2 47.68,23.46 43.18,18.96 | SV2.2 37.79,46.99 39.37,45.4 40.86,45.4 C5.2 41.43,45.04 U1.14 54.4,45.04 | 32.71,35.56 36.2,35.56 36.83,34.92 SV2.12 SV1.2 | 32.71,35.56 32.71,44.77 33.66,45.72 34.93,45.72 36.2,46.99 SV2.2 | SV5.2 65.41,34.29 66.68,35.56 73.03,35.56 74.3,34.29 | 54.4,45.09 54.4,45.84 U1.34 59.5,45.84 61.6,47.94 62.34,47.94 C8.2 64.67,48.16 64.77,48.26 | 54.4,45.04 54.4,37.84 | 54.4,45.04 54.4,45.09 | 54.4,45.09 50.4,45.09 U1.24 50.4,52.47 49.85,53.02 49.85,53.55 C3.2 50.17,53.87 | SV2.2 SV3.12 | SV5.2 SV6.12 | 27.94,26.67 OK6.3 | OK7.5 24.13,31.75 27.94,31.75 | 27.94,31.75 27.94,26.67 | 27.94,31.75 C12.1 | OK4.2 OK4.3 27.31,46.99 | 27.31,46.99 27.31,52.07 | 27.31,52.07 OK5.5 | 27.31,52.07 C9.1 | 27.31,46.99 29.85,46.99 30.17,47.31 30.17,51.12 31.12,52.07 31.12,53.34 33.02,55.24 33.02,60.33 33.66,60.96 34.93,60.96 36.2,62.23 SV3.2 | 64.77,48.26 SV4.2 65.41,49.53 66.68,50.8 67.95,50.8 70.49,53.34 71.12,53.34 72.39,54.61 74.3,54.61 | 64.77,48.26 SV5.12 | OK2.3 74.3,54.61 | OK3.5 74.3,49.53 | 74.3,49.53 74.3,54.61 | C10.1 74.3,49.53 | OK9.3 74.3,34.29 | 74.3,34.29 74.3,29.21 | 74.3,29.21 77.47,29.21 OK1.5 | C11.1 74.3,29.21 | 50.17,14.61 51.44,14.61 51.8,14.88 C1.1 | 50.17,14.61 49.53,14.61 U$2.P1 | C2.1 49.89,14.88 50.17,14.61 | SV6.2 62.87,19.05 55.25,11.43 50.8,11.43 U$2.P1 | SV1.12 43.09,19.05 43.18,18.96 | 43.18,18.96 43.27,18.96 U$2.P1 | 40.64,62.23 47.31,55.56 | 47.31,55.56 48.9,53.98 | 27.94,26.67 31.12,26.67 31.12,33.02 32.71,34.61 32.71,35.56
  Bottom 0.508: SV4.12 58.42,62.23 53.42,57.22 arc-45 53.24,57.15 v50.8,57.15 48.9,57.15 47.31,55.56
  Bottom 0.61: C2.1 | SV1.12 36.83,15.88 35.56,14.61 31.12,14.61 28.58,17.14 28.58,22.23 26.67,24.13 OK6.2 OK6.3
  Bottom 0.813: OK2.3 OK2.2 | OK9.3 OK9.2 | U$4.P1 50.8,71.75 48.24,71.75 IC5.1
  Bottom 1.27: IC5.1 43.18,74.02 | 43.18,74.02 v43.18,71.75 | 43.18,74.02 X2.8
  pour Bottom (isolate 0.61): 45.72,10.16 56.52,10.16 62.23,15.88 69.85,15.88 73.03,19.05 76.84,19.05 78.74,20.95 78.74,58.42 69.85,67.31 64.77,67.31 59.06,73.03 59.06,81.28 42.55,81.28 42.55,72.39 37.47,67.31 33.02,67.31 29.21,63.5 25.4,63.5 22.23,60.33 22.23,22.86 29.21,15.88 40.01,15.88
N$1
  Bottom 0.508: OK9.4 R34.2
N$2
  Bottom 0.813: OK2.4 R36.2
N$4
  Bottom 0.813: U$5.P2 53.98,66.67 55.25,67.94 55.25,72.39 53.34,74.3 X1.1
N$5
  Bottom 0.508: R35.1 78.11,40.64 78.74,41.27 78.74,58.42 OK2.1
N$7
  Bottom 0.508: OK4.1 22.23,41.91 22.23,60.33 23.5,61.59 R37.1
N$8
  Bottom 0.508: OK9.1 78.74,38.1 78.74,20.95 78.11,20.32 R33.1
N$9
  Bottom 0.508: R38.2 OK4.4
N$13
  Bottom 0.813: U$5.P1 56.52,67.31 56.52,72.39 58.42,74.3 X1.2
N$14  (via drill 1)
  other vias: 98.43,30.48
N$15  (via drill 1)
  other vias: 95.89,30.48
N$16  (via drill 1)
  other vias: 95.89,33.02
N$17  (via drill 1)
  other vias: 98.43,33.02
N$18  (via drill 1)
  other vias: 3.18,50.8
N$19  (via drill 1)
  other vias: 5.72,50.8
N$20  (via drill 1)
  other vias: 5.72,48.26
N$21  (via drill 1)
  other vias: 3.18,48.26
N$22  (via drill 1)
  other vias: 3.18,27.94
N$23  (via drill 1)
  other vias: 5.72,27.94
N$24  (via drill 1)
  other vias: 5.72,30.48
N$25  (via drill 1)
  other vias: 3.18,30.48
N$26  (via drill 1)
  other vias: 8.26,48.26
N$27  (via drill 1)
  other vias: 8.26,50.8
N$28  (via drill 1)
  other vias: 93.35,30.48
N$29  (via drill 1)
  other vias: 93.35,33.02
N$30  (via drill 1)
  Bottom 0.508: v95.89,53.34 v95.89,50.8
N$31  (via drill 1)
  other vias: 93.35,50.8
N$32  (via drill 1)
  other vias: 98.43,50.8
PA0
  Bottom 0.406: 45.09,24.46 45.09,27.62 44.45,28.26 44.45,29.53 46.4,31.48
  Bottom 0.508: 46.4,31.48 U1.62 | SV1.10 42.22,21.59 45.09,24.46
PA1
  Bottom 0.406: 44.45,25.56 44.45,26.99 43.82,27.62 43.82,30.16 45.6,31.95
  Bottom 0.508: 45.6,31.95 U1.63 | SV1.9 35.56,22.86 41.75,22.86 44.45,25.56
PA2
  Bottom 0.406: 43.18,26.14 43.18,31.43 44.59,32.84
  Bottom 0.508: 44.59,32.84 U1.64 | SV1.8 41.17,24.13 43.18,26.14
PA3_
  Bottom 0.406: 42.55,27.3 42.55,34.29 42.9,34.64
  Bottom 0.508: SV1.7 35.56,25.4 40.64,25.4 42.55,27.3
PA4
  Bottom 0.406: 42.11,35.44 41.91,35.24 41.91,28.47
  Bottom 0.508: U1.2 42.11,35.44 | SV1.6 40.12,26.67 41.91,28.47
PA5
  Bottom 0.406: 41.96,36.24 41.28,35.56 41.28,29.84 41.28,29.69
  Bottom 0.508: U1.3 41.96,36.24 | SV1.5 35.56,27.94 39.37,27.94 41.28,29.84
PA6
  Bottom 0.406: 41.81,37.04 40.64,35.88 40.64,30.79
  Bottom 0.508: U1.4 41.81,37.04 | SV1.4 39.37,29.21 40.64,30.48 40.64,30.79
PA7
  Bottom 0.406: 41.65,37.84 40.01,36.2 40.01,31.91
  Bottom 0.508: U1.5 41.65,37.84 | SV1.3 35.56,30.48 38.74,30.48 40.01,31.75 40.01,31.91
PB0
  Bottom 0.406: 41.5,38.64 39.69,36.83
  Bottom 0.508: U1.6 41.5,38.64 | 39.69,36.83 SV2.10
PB1
  Bottom 0.406: 41.35,39.44 40.01,38.1
  Bottom 0.508: U1.7 41.35,39.44 | 40.01,38.1 35.56,38.1 SV2.9
PB2
  Bottom 0.406: 41.2,40.24 40.33,39.37
  Bottom 0.508: U1.8 41.2,40.24 | 40.33,39.37 SV2.8
PB3
  Bottom 0.508: U1.9 40.73,41.04 40.33,40.64 35.56,40.64 SV2.7
PB4
  Bottom 0.508: U1.10 36.9,41.84 SV2.6
PB5
  Bottom 0.508: U1.11 38.01,42.64 37.47,43.18 35.56,43.18 SV2.5
PB6
  Bottom 0.508: U1.12 38.48,43.44 37.47,44.45 SV2.4
PB7
  Bottom 0.508: U1.13 38.95,44.24 37.47,45.72 36.2,45.72 34.93,44.45 SV2.3
PC0_TXE0
  Bottom 0.508: U1.16 43.18,46.82 43.18,48.58 39.69,52.07 SV3.10 36.2,52.07 34.93,50.8 33.66,50.8 33.02,50.16 33.02,46.35 31.75,45.09 31.75,34.92 29.85,33.02 29.85,29.69 R32.1
PC1
  Bottom 0.508: U1.17 44.67,48.58 44.29,48.58 39.53,53.34 36.2,53.34 34.93,52.07 SV3.9
PC2_RXD0
  Bottom 0.508: U1.18 45.6,49.65 40.64,54.61 SV3.8 36.2,54.61 34.93,53.34 33.66,53.34 33.02,52.7 33.02,51.44 32.07,50.32 32.07,46.67 30.8,45.4 30.8,39.05 | OK7.6 24.14,34.29 29.85,34.29 30.8,35.24 30.8,39.05 | R29.2 30.64,38.89 30.8,39.05
PC3_TXD0
  Bottom 0.508: U1.19 46.4,50.12 40.64,55.88 35.56,55.88 SV3.7 33.66,54.61 32.07,53.02 32.07,51.75 31.12,50.8 31.12,46.99 29.85,45.72 29.85,41.12 R39.2
PC4
  Bottom 0.508: U1.20 47.2,50.59 40.64,57.15 SV3.6
PC5
  Bottom 0.508: U1.21 48,51.06 40.64,58.42 35.56,58.42 SV3.5
PC6
  Bottom 0.508: U1.22 48.8,51.53 40.64,59.69 SV3.4
PC7
  Bottom 0.508: U1.23 49.6,52 40.64,60.96 36.2,60.96 34.93,59.69 SV3.3
PD0_TXE0
  Bottom 0.508: U1.26 52,51.68 60.01,59.69 SV4.10 65.41,59.69 66.68,60.96 68.58,60.96 69.22,61.59 69.22,64.14 68.58,64.77 58.42,64.77 53.34,59.69 45.72,59.69 40.64,64.77 34.29,64.77 31.75,62.23 31.75,56.52 28.73,53.49 R38.1
PD1
  Bottom 0.508: U1.27 52.8,51.21 60.01,58.42 65.41,58.42 66.68,59.69 SV4.9
PD2_RXD0
  Bottom 0.508: U1.28 53.6,50.32 60.44,57.15 SV4.8 65.41,57.15 66.68,58.42 67.95,58.42 70.49,60.96 70.49,64.77 69.22,66.04 58.42,66.04 53.34,60.96 45.72,60.96 40.64,66.04 33.66,66.04 30.48,62.87 30.48,59.69 | OK5.6 28.59,54.62 30.48,56.52 30.48,59.69 | R28.2 28.58,60.01 28.9,59.69 30.48,59.69
PD3_TXD0
  Bottom 0.508: U1.29 54.4,49.95 55.57,51.12 56.2,51.12 60.96,55.88 66.04,55.88 SV4.7 68.58,57.15 71.76,60.33 71.76,65.41 69.85,67.31 58.42,67.31 53.34,62.23 45.72,62.23 40.64,67.31 33.02,67.31 29.21,63.5 29.21,61.59 R37.2
PD4
  Bottom 0.508: U1.30 55.2,49.64 55.88,50.32 57.2,50.32 61.49,54.61 SV4.6
PD5
  Bottom 0.508: U1.31 56,49.33 56.2,49.53 58.26,49.53 62.07,53.34 66.04,53.34 SV4.5
PD6
  Bottom 0.508: U1.32 58.91,48.44 62.54,52.07 SV4.4
PD7
  Bottom 0.508: 58.87,46.64 U1.33 62.76,50.8 65.41,50.8 66.68,52.07 SV4.3
PDI
  Bottom 0.508: U1.56 51.2,25 55.88,20.32 55.88,14.61 54.61,13.34 U$1.P1
PE0_TXE0
  Bottom 0.508: U1.36 64.56,44.24 SV5.10 65.41,44.45 66.68,45.72 67.95,45.72 72.88,50.65 R36.1
PE1
  Bottom 0.508: U1.37 63.88,43.44 64.14,43.18 65.41,43.18 66.68,44.45 SV5.9
PE2_RXD0
  Bottom 0.508: U1.38 63.09,42.64 63.82,41.91 SV5.8 65.41,41.91 66.68,43.18 69.22,43.18 | OK3.6 71.12,46.99 69.22,45.09 69.22,43.18 | R26.2 69.85,42.55 69.22,43.18
PE3_TXD0
  Bottom 0.508: U1.39 62.62,41.84 63.82,40.64 66.04,40.64 SV5.7 68.58,40.64 R35.2
PE4
  Bottom 0.508: U1.40 62.15,41.04 63.82,39.37 SV5.6
PE5
  Bottom 0.508: U1.41 61.68,40.24 63.82,38.1 66.04,38.1 SV5.5
PE6
  Bottom 0.508: U1.42 61.21,39.44 63.82,36.83 SV5.4
PE7
  Bottom 0.508: U1.43 60.74,38.64 63.82,35.56 65.41,35.56 66.68,36.83 SV5.3
PF0_TXE0
  Bottom 0.508: U1.46 59.65,36.24 60.65,35.24 60.65,31.11 62.54,29.21 SV6.10 65.41,29.21 66.68,30.48 67.95,30.48 69.22,31.75 R34.1
PF1_
  Bottom 0.508: U1.47 59.5,35.44 59.69,35.24 59.69,30.32 62.07,27.94 65.41,27.94 66.68,29.21 SV6.9
PF2_RXD0
  Bottom 0.508: U1.48 58.42,34.46 58.42,31.91 58.9,31.43 58.9,29.37 61.6,26.67 SV6.8 65.41,26.67 66.68,27.94 67.95,27.94 70.49,25.4 | 70.49,25.4 70.49,22.86 71.12,22.23 R25.2 72.39,22.55 | OK1.6 71.77,26.68 70.49,25.4
PF3_TXD0
  Bottom 0.508: U1.49 56.8,32.42 58.11,31.11 58.11,28.26 60.96,25.4 66.04,25.4 SV6.7 69.22,24.77 69.22,22.23 71.12,20.32 R33.2
PF4
  Bottom 0.508: U1.50 56,31.95 57.15,30.8 57.15,27.41 60.44,24.13 SV6.6
PF5
  Bottom 0.508: U1.51 55.2,31.48 56.2,30.48 56.2,26.67 60.01,22.86 66.04,22.86 SV6.5
PF6
  Bottom 0.508: U1.54 52.8,28.8 60.01,21.59 SV6.4
PF7
  Bottom 0.508: U1.55 52,28.33 60.01,20.32 66.04,20.32 SV6.3
R0
  Bottom 0.508: OK1.3 93.83,26.68 IC1.1
R0A
  Bottom 0.508: OK1.2 87.94,24.14 arc-90 R49.2
R1  (via drill 1)
  Bottom 0.508: OK3.3 98.43,46.99 arc45 98.43,46.99 | IC2.1 97.79,53.98 v98.43,53.34
  Bottom 1.27: v98.43,53.34 98.43,46.99
R1A
  Bottom 0.508: OK3.2 87.95,44.45 R27.2
R2
  Bottom 0.508: OK5.3 7.62,54.62 IC3.1
R2A
  Bottom 0.508: OK5.2 16.51,57.15 13.02,57.15 R30.2
R3
  Bottom 0.508: OK7.3 | 3.18,27.3 4.06,26.43 arc-45 4.13,26.25 IC4.1
  Bottom 1.27: OK7.3 3.18,34.29 3.18,27.3
R3A
  Bottom 0.508: OK7.2 14.62,36.84 13.97,36.2 12.86,36.2 R31.2
RESET
  Bottom 0.508: U1.57 50.4,24.53 54.61,20.32 54.61,15.88 52.07,13.34 U$1.P2
S0A
  Bottom 0.61: D1.3 96.54,16.2 R3.2 100.12,16.2 R1.1
  Bottom 0.813: 99.46,18.57 R1.1
S0B
  Bottom 0.61: D1.2 95.24,16.2 R4.2 91.66,16.2 R2.1
S1A
  Bottom 0.61: R20.1 91.6,64.93 R13.2 94.46,66.25 D2.3
S1B
  Bottom 0.61: D2.2 97.48,66.25 R14.2 100.17,64.93 R19.1
S2A
  Bottom 0.61: R22.1 1.43,64.93 R15.2 4.29,66.25 D3.3
S2B
  Bottom 0.61: D3.2 7.15,66.25 R16.2 10,64.93 R21.1
S3A
  Bottom 0.508: D4.3 6.69,16.35 R17.2 7.78,16.51 8.89,16.51 9.53,17.14 9.53,18.23 R24.1
S3B
  Bottom 0.508: D4.2 5.39,16.35 R18.2
  Bottom 0.61: R23.1 1.43,16.35 R18.2
T0A
  Bottom 0.508: IC1.6 96.37,22.71 97.16,23.5 R5.2
  Bottom 0.61: IC1.6 96.37,18.09 R3.1
T0B
  Bottom 0.508: IC1.7 95.1,23.01 94.62,23.5 R6.2
  Bottom 0.61: IC1.7 95.1,18.09 R4.1
T1A
  Bottom 0.61: R13.1 95.25,63.03 IC2.6 95.25,57.94 92.71,57.94 R7.2
T1B
  Bottom 0.61: R14.1 96.52,63.03 IC2.7 96.52,57.94 97.16,57.31 99.07,57.31 R8.2
T2A
  Bottom 0.61: R15.1 5.08,63.03 IC3.6 5.08,57.79 R9.2
T2B
  Bottom 0.61: R16.1 6.35,63.03 IC3.7 6.35,57.79 R10.2
T3A
  Bottom 0.508: IC4.6 6.67,23.18 6.99,23.5 R11.2
  Bottom 0.61: IC4.6 6.67,18.25 R17.1
T3B
  Bottom 0.508: IC4.7 5.4,23.18 5.08,23.5 R12.2
  Bottom 0.61: IC4.7 5.4,18.25 R18.1
TX3A
  Bottom 0.508: OK6.1 22.23,22.86 22.23,40.64 R39.1
TXE3A
  Bottom 0.508: R32.2 OK6.4
VCC  (via drill 1)  (1 unrouted)
  Top 0.508: v72.39,24.77 69.85,22.23 v69.85,16.51 | v70.49,50.8 v70.49,44.45 | v67.31,16.51 69.22,18.41 69.22,24.77 69.85,25.4 v69.85,34.29 | v39.37,48.26 39.37,49.53 v47.63,57.78 | v72.39,34.29 v72.39,45.72 | U$3.P2 51.54,55.24 arc45 51.36,55.17 49.53,53.34 49,53.34 arc-45 48.82,53.41 46.99,55.24 48.9,57.15 48.9,60.85 arc45 48.82,61.03 v43.18,66.67 | v58.42,12.7 58.42,51.81 arc45 58.35,51.99 v54.3,56.04 | v27.31,57.78 27.31,38.73 v29.21,36.83 | v26.67,36.83 30.48,33.02 v32.39,33.02 | v28.58,57.78 28.58,59.05 38.74,69.22 v43.18,69.22
  Bottom 0.406: U$3.P2 52.07,54.08 C3.1
  Bottom 0.508: U1.15 42.33,45.84 C5.1 40.96,48.26 40.96,48.58 | U1.25 51.2,52.47 51.44,52.7 51.44,53.44 C3.1 | C6.1 54.87,28.42 54.45,28.42 53.6,29.27 U1.53 53.6,34.66 47.2,34.66 U1.61 47.2,31.01 46.04,29.84 46.04,28.95 C4.1 45.98,24.98 46.36,24.61 46.36,23.97 42.71,20.32 35.56,20.32 SV1.11 | U1.45 59.8,37.04 61.44,35.4 61.44,32.86 61.6,32.7 62.45,32.7 62.55,32.6 62.55,31.11 63.19,30.48 65.41,30.48 66.68,31.75 SV6.11 67.31,33.66 69.22,33.66 v69.85,34.29 v72.39,34.29 | U1.35 59.97,45.04 61.28,46.35 62.45,46.35 C8.1 63.4,46.46 64.14,45.72 65.41,45.72 66.68,46.99 SV5.11 SV4.1 69.22,49.53 v70.49,50.8 | 51.65,53.71 C3.1 | SV2.1 SV3.11 34.93,49.53 36.2,50.8 38.74,50.8 38.74,48.9 v39.37,48.26 | OK7.8 27.31,39.38 | 27.31,39.38 27.93,39.38 27.94,39.37 27.94,36.83 | 27.94,36.83 C12.2 27.81,35.69 v26.67,36.83 | R29.1 27.47,39.22 27.31,39.38 | 66.68,62.23 65.41,60.96 59.32,60.96 arc45 59.14,60.89 v54.3,56.04 54.3,55.67 arc-45 54.22,55.49 52.71,53.98 52.28,53.98 arc-45 52.1,54.05 52.07,54.08 | 66.68,62.23 SV4.11 | SV3.1 35.56,63.5 40.64,63.5 45.72,58.42 47.63,58.42 | 24.14,59.69 R28.1 | R28.1 26.36,56.96 C9.2 | C10.2 74.3,42.23 R26.1 75.57,42.55 76.2,41.91 OK3.8 | 77.47,21.59 76.2,21.59 75.57,22.23 R25.1 74.3,22.54 74.3,24.77 | C11.2 74.3,24.77 | 66.68,62.23 65.41,63.5 58.42,63.5 53.34,58.42 47.63,58.42 | 74.3,24.77 v72.39,24.77 | C10.2 74.3,45.72 | R28.1 26.36,58.1 26.67,57.78 | SV2.11 34.29,33.02 | 34.29,33.02 SV1.1 32.39,29.84 32.39,16.51 | v70.49,44.45 71.12,44.45 v72.39,45.72 74.17,45.72 C10.2 | v47.63,57.78 47.63,58.42 | 51.97,53.98 C3.1 | v29.21,36.83 27.94,36.83 | v32.39,33.02 34.29,33.02
  Bottom 0.508: v27.31,57.78 v28.58,57.78
  Bottom 0.61: SV5.1 67.31,33.66 | v39.37,48.26 40.96,48.26 | OK5.8 24.13,59.7 24.14,59.69 | 26.67,57.78 v27.31,57.78
  Bottom 0.813: v67.31,16.51 62.23,16.51 v58.42,12.7 55.88,10.16 49.53,10.16 U$2.P2 | v67.31,16.51 SV6.1 | SV1.11 v34.29,16.51 32.39,16.51 v31.75,16.51 | v69.85,16.51 v67.31,16.51
  Bottom 1.27: IC5.3 43.22,66.72 v43.18,66.67 v43.18,69.22
VIN
  Bottom 0.813: IC5.2 51.08,74.02 U$4.P2
  Bottom 1.27: X2.9 48.26,76.3 IC5.2
XTAL1
  Bottom 0.508: Q1.1 53.27,18.68 52.75,19.2 51.8,19.2 | C1.2 51.8,19.2 | U1.58 49.6,23.11 51.76,20.95 51.76,19.24 51.8,19.2
  Bottom 0.61: 51.92,17.8 C1.2
XTAL2
  Bottom 0.508: 49.76,17.8 49.76,19.01 | U1.59 48.8,22.32 49.85,21.27 49.85,19.1 49.76,19.01 | Q1.2 48.44,18.91 48.58,19.05 49.72,19.05 49.76,19.01
  Bottom 0.61: 49.76,17.8 C2.2
(copper drawn outside any net)
  shapes: Bottom circle x4